# EAGLE design wifibasestation-tssop (EAGLE 6.5.0)
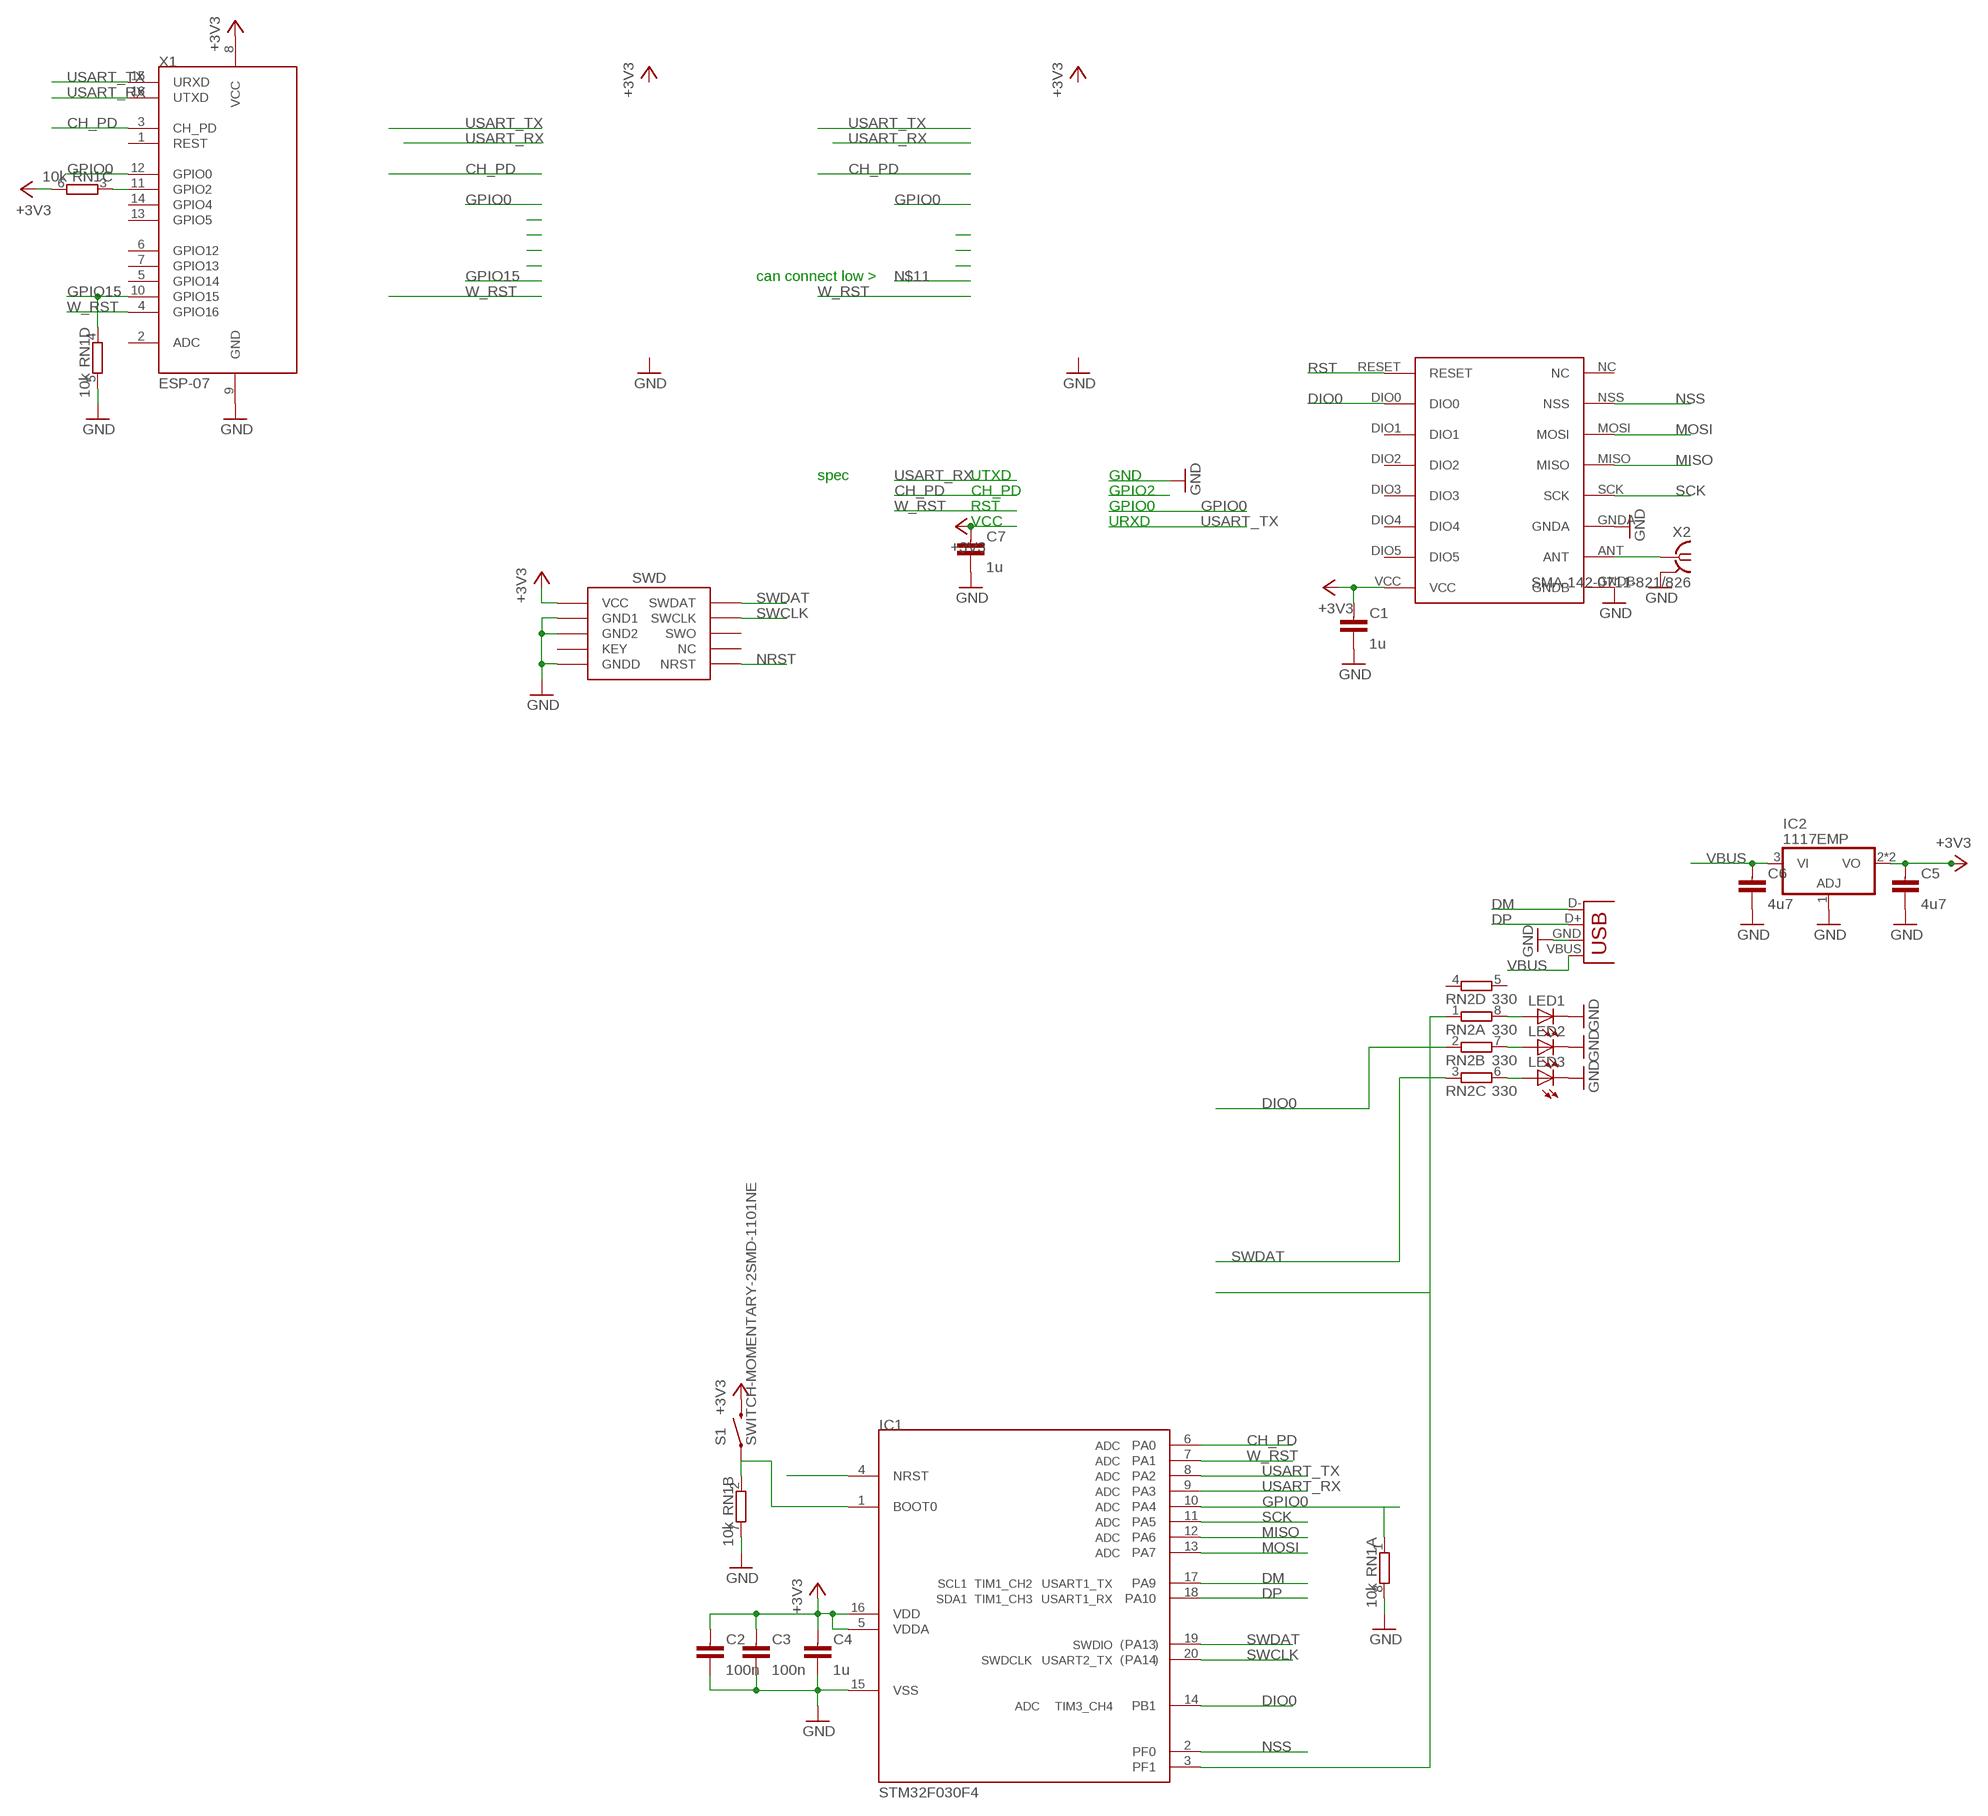
[diagram p0: schematic, sheet 1]

## Parts
C1  1u  CAPACITOR0603-N  [C0603-N]
C2  100n  CAPACITOR0603-N  [C0603-N]
C3  100n  CAPACITOR0603-N  [C0603-N]
C4  1u  CAPACITOR0603-N  [C0603-N]
C5  4u7  CAPACITOR0805-N  [C0805-N]
C6  4u7  CAPACITOR0603-N  [C0603-N]
C7  1u  CAPACITOR0603-N  [C0603-N]
IC1  STM32F030F4  [TSSOP20]
IC2  1117EMP  [SOT223]
J1  SWD_SHROUD_SMD  [SWD_SMD_SHROUD]
JP1  USB-A-H  [USB-A-H]
LED1  LEDCHIP-LED0805  [CHIP-LED0805]
LED2  LEDCHIP-LED0805  [CHIP-LED0805]
LED3  LEDCHIP-LED0805  [CHIP-LED0805]
RN1  10k  4R-NEXB38V  [EXB38V]
RN2  330  4R-NEXB38V  [EXB38V]
S1  SWITCH-MOMENTARY-2SMD-1101NE  [TACTILE-SWITCH-1101NE]
U$1  RFM69HW  [RFM]
X1  ESP-07  [ESP-07]
X2  SMA-142-0711-821/826  [J502-ND-142-0711-821/826]

## Nets
+3V3: C1.1 C2.1 C3.1 C4.1 C5.1 C7.1 IC1.5(VDDA) IC1.16(VDD) IC2.2(VO) IC2.4(VO) J1.1(VCC) RN1.6 S1.2 U$1.VCC X1.8(VCC)
CH_PD: IC1.6(PA0) X1.3(CH_PD)
DIO0: IC1.14(PB1) RN2.2 U$1.DIO0
DM: IC1.17(PA9) JP1.D-(D+)
DP: IC1.18(PA10) JP1.D+(D-)
GND: C1.2 C2.2 C3.2 C4.2 C5.2 C6.2 C7.2 IC1.15(VSS) IC2.1(ADJ) J1.3(GND1) J1.5(GND2) J1.9(GNDD) JP1.GND(VBUS) LED1.C LED2.C LED3.C RN1.5 RN1.7 RN1.8 U$1.GNDA U$1.GNDB X1.9(GND) X2.G@1 X2.G@2 X2.G@3 X2.G@4
GPIO0: IC1.10(PA4) RN1.1 X1.12(GPIO0)
GPIO15: RN1.4 X1.10(GPIO15)
MISO: IC1.12(PA6) U$1.MISO
MOSI: IC1.13(PA7) U$1.MOSI
N$2: IC1.1(BOOT0) RN1.2 S1.1
N$6: U$1.ANT X2.1
N$8: RN1.3 X1.11(GPIO2)
N$9: LED1.A RN2.8
N$10: LED2.A RN2.7
N$20: LED3.A RN2.6
N$22: IC1.3(PF1) RN2.1
NRST: IC1.4(NRST) J1.10(NRST)
NSS: IC1.2(PF0) U$1.NSS
RST: U$1.RESET
SCK: IC1.11(PA5) U$1.SCK
SWCLK: IC1.20(PA14) J1.4(SWCLK)
SWDAT: IC1.19(PA13) J1.2(SWDAT) RN2.3
USART_RX: IC1.9(PA3) X1.16(UTXD)
USART_TX: IC1.8(PA2) X1.15(URXD)
VBUS: C6.1 IC2.3(VI) JP1.VBUS(GND)
W_RST: IC1.7(PA1) X1.4(GPIO16)
Unconnected: J1.6(SWO) J1.7(KEY) J1.8(NC) RN2.4 RN2.5 U$1.DIO1 U$1.DIO2 U$1.DIO3 U$1.DIO4 U$1.DIO5 U$1.NC X1.1(REST) X1.2(ADC) X1.5(GPIO14) X1.6(GPIO12) X1.7(GPIO13) X1.13(GPIO5) X1.14(GPIO4)

## Notes on the sheet
- can connect low >
- spec | UTXD | GND
- CH_PD | GPIO2
- RST | GPIO0
- VCC | URXD

## Library data of the parts
C1-C7 = passives-7351:CAPACITOR
IC1 = dtb:STM32F030F4
IC2 = dtb:*1117: Positive VOLTAGE REGULATOR
J1 = dtb:SWD_SHROUD
JP1 = SparkFun-Connectors:USB: USB Connectors USB-B-PTH is fully proven SKU : PRT-00139/CONN-08278 USB-miniB is fully proven SKU : PRT-00587 USB-A-PCB is untested. USB-A-H is throughly reviewed, but untested. Spark Fun Electronics SKU : PRT-00437 USB-B-SMT is throughly reviewed, but untested. Needs silkscreen touching up. USB-A-S has not been used/tested USB-MB-H has not been used/tested USB-MICROB has been used. CONN-09505
LED1-LED3 = led:LED: LED OSRAM: - CHIPLED LG R971, LG N971, LY N971, LG Q971, LY Q971, LO R971, LY R971 LH N974, LH R974 LS Q976, LO Q976, LY Q976 LO Q996 - Hyper CHIPLED LW Q18S LB Q993, LB Q99A, LB R99A - SideLED LS A670, LO A670, LY A670, LG A670, LP A670 LB A673, LV A673, LT A673, LW A673 LH A674 LY A675 LS A676, LA A676, LO A676, LY A676, LW A676 LS A679, LY A679, LG A679 - Hyper Micro SIDELED® LS Y876, LA Y876, LO Y876, LY Y876 LT Y87S - SmartLED LW L88C, LW L88S LB L89C, LB L89S, LG L890 LS L89K, LO L89K, LY L89K LS L896, LA L896, LO L896, LY L896 - TOPLED LS T670, LO T670, LY T670, LG T670, LP T670 LSG T670, LSP T670, LSY T670, LOP T670, LYG T670 LG T671, LOG T671, LSG T671 LB T673, LV T673, LT T673, LW T673 LH T674 LS T676, LA T676, LO T676, LY T676, LB T676, LH T676, LSB T676, LW T676 LB T67C, LV T67C, LT T67C, LS T67K, LO T67K, LY T67K, LW E67C LS E67B, LA E67B, LO E67B, LY E67B, LB E67C, LV E67C, LT E67C LW T67C LS T679, LY T679, LG T679 LS T770, LO T770, LY T770, LG T770, LP T770 LB T773, LV T773, LT T773, LW T773 LH T774 LS E675, LA E675, LY E675, LS T675 LS T776, LA T776, LO T776, LY T776, LB T776 LHGB T686 LT T68C, LB T68C - Hyper Mini TOPLED® LB M676 - Mini TOPLED Santana® LG M470 LS M47K, LO M47K, LY M47K Source: http://www.osram.convergy.de LUXEON: - LUMILED® LXK2-PW12-R00, LXK2-PW12-S00, LXK2-PW14-U00, LXK2-PW14-V00 LXK2-PM12-R00, LXK2-PM12-S00, LXK2-PM14-U00 LXK2-PE12-Q00, LXK2-PE12-R00, LXK2-PE12-S00, LXK2-PE14-T00, LXK2-PE14-U00 LXK2-PB12-K00, LXK2-PB12-L00, LXK2-PB12-M00, LXK2-PB14-N00, LXK2-PB14-P00, LXK2-PB14-Q00 LXK2-PR12-L00, LXK2-PR12-M00, LXK2-PR14-Q00, LXK2-PR14-R00 LXK2-PD12-Q00, LXK2-PD12-R00, LXK2-PD12-S00 LXK2-PH12-R00, LXK2-PH12-S00 LXK2-PL12-P00, LXK2-PL12-Q00, LXK2-PL12-R00 Source: www.luxeon.com KINGBRIGHT: KA-3528ASYC Source: www.kingbright.com
RN1 RN2 = resistor-dil:4R-N: Array Chip Resistor Source: RS Component / Phycomp; OC_FARNELL: unknown; OC_NEWARK: unknown
S1 = SparkFun-Electromechanical:SWITCH-MOMENTARY-2: Various NO switches- pushbuttons, reed, etc; PROD_ID: SWCH-00815
U$1 = hoperf:RFM69HW
X1 = TiLDA Mk3 Parts:ESP-07
X2 = con-coax:SMA-: SMA 50 Ohm End Launch Jack Receptacle - Round Contact Johnson Components Source: www.johnsoncomponents.com .. J502-ND.pdf; MF: JOHNSON COMPONENTS; MPN: 142-0711-821; OC_FARNELL: 1019328; OC_NEWARK: 16F3627

## Board
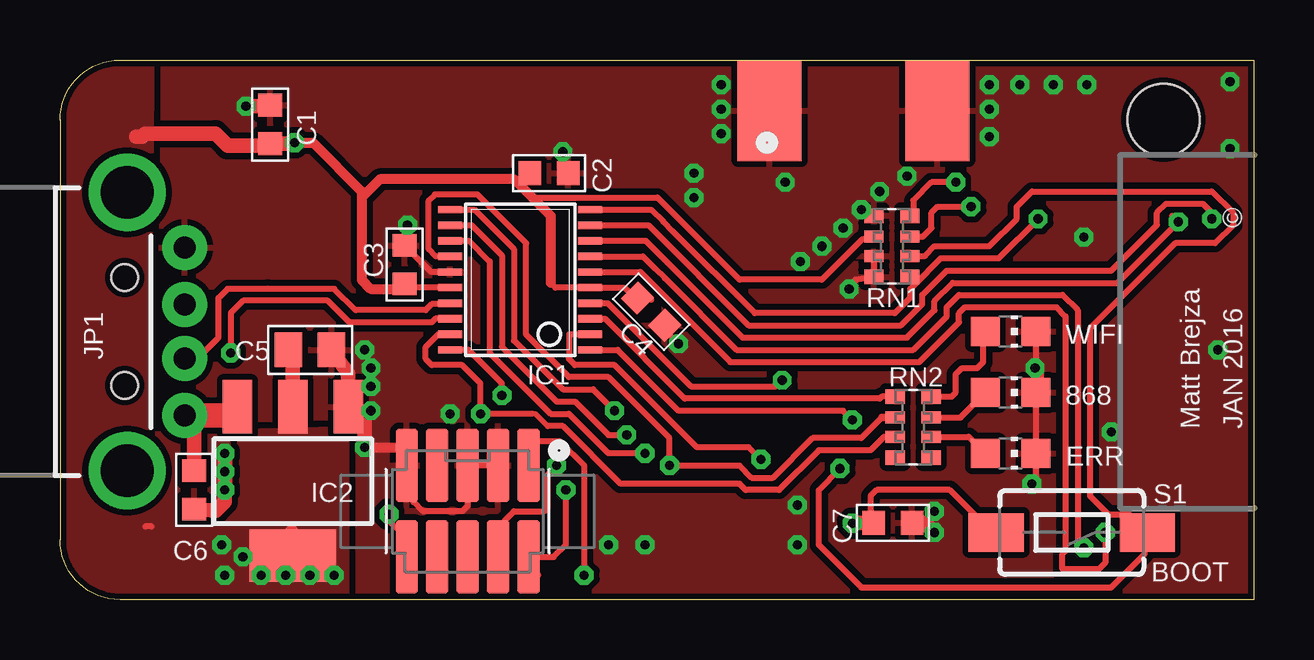
[diagram p1: board, top side]
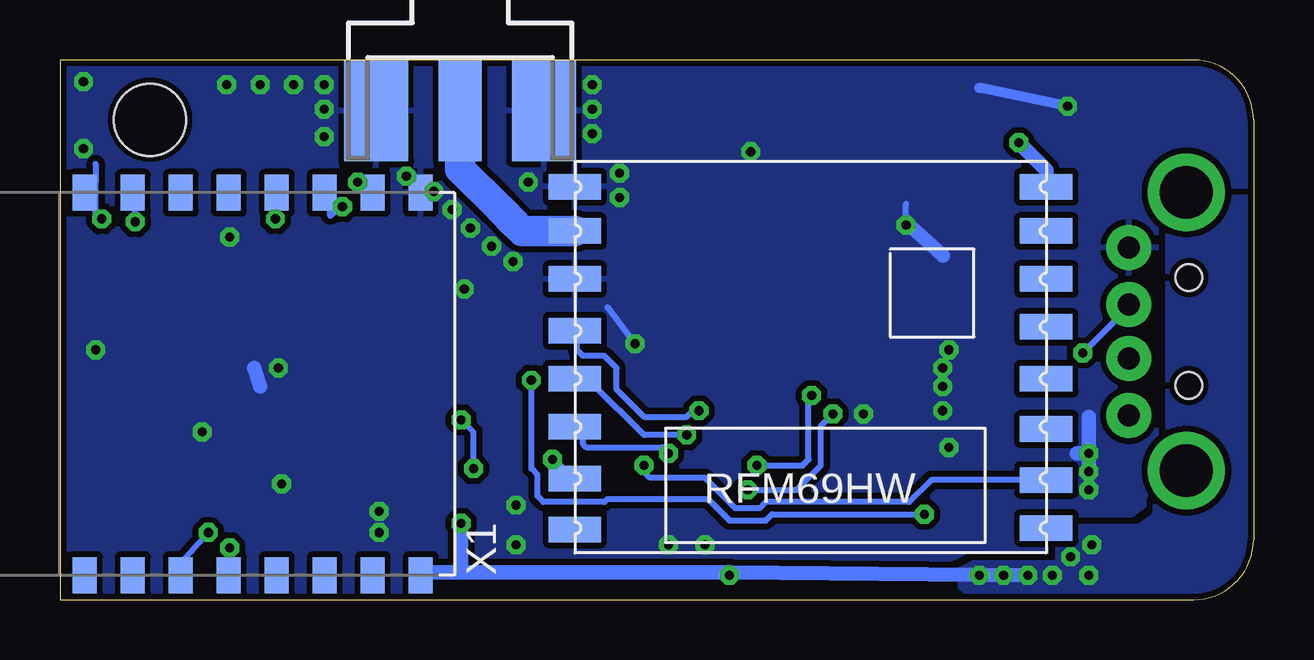
[diagram p2: board, bottom side, seen from below]

Size 49.75 x 22.5 mm. Coordinates in mm from the lower left corner, seen from the top.
Outline: 0,20.01 0,20
Outline: 0,20 0,2.5 arc90 2.5,0 49.75,0 49.75,22.5 2.5,22.5 arc90 0,20
Copper layers (1*16): Top 0.035mm / dielectric 1.5mm / Bottom 0.035mm
Design rules "default *": minimum track width 8mil, minimum drill 15mil, track to track 8mil, track to pad 8mil, pad to pad 7mil, via to via 8mil, smd to smd 0mil, copper to edge 10mil, drill to drill 8mil, minimum pad ring 10mil, minimum via ring 8mil, stop-mask expansion 4mil, vias tented up to drill 16mil, thermal gap 10mil
Holes 3 mm at 45.99,20.01

### Footprints (pad centres in the part's own frame; a part is rotated, then mirrored left to right if it is on the bottom)
C0603-N = smd 0.95 x 1: 1 -0.8,0; 2 0.8,0
C0805-N = smd 1.15 x 1.45: 1 -0.9,0; 2 0.9,0
TSSOP20 = smd 0.305 x 0.991: 1 -2.925,-2.918; 2 -2.275,-2.918; 3 -1.625,-2.918; 4 -0.975,-2.918; 5 -0.325,-2.918; 6 0.325,-2.918; 7 0.975,-2.918; 8 1.625,-2.918; 9 2.275,-2.918; 10 2.925,-2.918; 11 2.925,2.918; 12 2.275,2.918; 13 1.625,2.918; 14 0.975,2.918; 15 0.325,2.918; 16 -0.325,2.918; 17 -0.975,2.918; 18 -1.625,2.918; 19 -2.275,2.918; 20 -2.925,2.918
SOT223 = smd 1.219 x 2.235: 1 -2.311,-3.099; 2 0,-3.099; 3 2.311,-3.099 | smd 3.6 x 2.2: 4 0,3.099
SWD_SMD_SHROUD = smd 0.914 x 3.048: 1 -2.54,-1.905; 2 -2.54,1.905; 3 -1.27,-1.905; 4 -1.27,1.905; 5 0,-1.905; 6 0,1.905; 7 1.27,-1.905; 8 1.27,1.905; 9 2.54,-1.905; 10 2.54,1.905
USB-A-H = drill 0.914 pad 1.88: D+ 2.4,1.127; D- 2.4,-1.127; GND 2.4,3.5; VBUS 2.4,-3.5 | drill 2.2: GND2 0,-5.8; GND3 0,5.8 | hole 1.1: -0.1,2.25; -0.1,-2.25
CHIP-LED0805 = smd 1.2 x 1.2: A 0,-1.05; C 0,1.05
EXB38V = smd 0.6 x 0.8: 1 -1.275,-0.75; 4 1.275,-0.75; 5 1.275,0.75; 8 -1.275,0.75 | smd 0.5 x 0.8: 2 -0.4,-0.75; 3 0.4,-0.75; 6 0.4,0.75; 7 -0.4,0.75
TACTILE-SWITCH-1101NE = smd 2.3 x 1.6: 1 -3.15,0; 2 3.15,0
RFM = smd 2.184 x 1.067: ANT 19.651,2.889; DIO0 0,13.27; DIO1 0,11.143; DIO2 0,9.047; DIO3 0,6.889; DIO4 0,4.889; DIO5 0,2.889; GNDA 19.651,4.889; GNDB 19.651,1.048; MISO 19.651,9.047; MOSI 19.651,11.047; NC 19.651,15.334; NSS 19.651,13.206; RESET 0,15.27; SCK 19.651,7.048; VCC 0,1.048
ESP-07 = smd 1 x 1.5: 1 -13.4,0; 2 -11.4,0; 3 -9.4,0; 4 -7.4,0; 5 -5.4,0; 6 -3.4,0; 7 -1.4,0; 8 0.6,0; 9 0.6,15.95; 10 -1.4,15.95; 11 -3.4,15.95; 12 -5.4,15.95; 13 -7.4,15.95; 14 -9.4,15.95; 15 -11.4,15.95; 16 -13.4,15.95
J502-ND-142-0711-821/826 = smd 4.191 x 1.778: 1 2.115,0 | smd 4.191 x 2.667: G@1 2.115,3.495; G@2 2.115,-3.495 | smd 4.191 x 2.667 bottom: G@3 2.115,3.495; G@4 2.115,-3.495

### Placement (x,y rotation side)
C1  8.77,19.82 90 top
C2  20.39,17.78 0 top
C3  14.37,13.97 90 top
C4  24.64,12.01 315 top
C5  10.42,10.42 0 top
C6  5.59,4.58 270 top
C7  34.72,3.2 0 top
IC1  19.18,13.34 90 top
IC2  9.71,4.94 180 top
J1  16.99,3.69 180 top
JP1  2.8,11.18 0 top
LED1  39.63,11.18 270 top
LED2  39.63,8.64 270 top
LED3  39.63,6.1 270 top
RN1  34.67,14.74 90 top
RN2  35.56,7.2 270 top
S1  42.17,2.8 180 top
U$1  8.64,18.26 180 bottom
X1  35.31,1.02 0 bottom
X2  33.07,22.5 270 bottom

### Tracks (layer width: path | path; a pad name or v marks a point on that pad's centre or on a via)
+3V3  (via drill 0.38)
  Top 0.254: 3.81,3.05 3.56,3.05 | 9.66,10.28 C5.1 | 19.53,5.81 J1.1 19.56,5.62 19.56,6.35 19.82,6.61 20.83,6.61 21.85,5.59 v21.85,1.02 | S1.2 38.87,2.8 37.09,4.58 34.04,4.58 33.79,4.32 33.79,3.33 C7.1 | 24.65,12.51 C4.1 23.51,13.01 IC1.5 20.65,13.01 20.45,13.21 | RN1.6 33.42,15.01 31.75,13.34 28.32,13.34 24.9,16.77 19.69,16.77 | IC1.16 14.36,13.01 14.37,13.03 C3.1 | C2.1 19.59,17.68 19.18,17.28
  Top 0.406: 3.56,19.43 3.43,19.31 | 20.45,13.21 20.45,16.01 19.69,16.77 19.18,17.28 18.93,17.53 13.34,17.53 12.58,16.77 | v9.78,19.05 10.54,19.05 12.58,17.02 12.58,16.77 | 12.58,16.77 12.58,13.34 12.96,12.96 14.16,12.96 C3.1
  Top 0.61: 9.66,2.8 9.91,2.54 | IC2.2 9.71,10 C5.1 | 3.18,19.31 3.43,19.31 | C7.1 33.04,3.2 v33.02,3.18 | 3.56,19.43 6.48,19.43 6.99,18.93 8.68,18.93 C1.1 9.74,19.02 v9.78,19.05
  Bottom 0.254: v21.85,1.02 21.85,1.15
  Bottom 0.61: v9.4,1.02 21.85,1.15 33.28,1.15 | 33.28,1.15 34.58,1.15 X1.8 34.55,1.18 | v33.02,3.18 33.02,1.4 33.28,1.15 | U$1.VCC 8.64,17.91 v9.78,19.05
  other vias: 6.74,2.29 7.62,1.78 8.39,1.02 10.42,1.02 11.43,1.02 6.86,1.02
  pour Top (isolate 0.254): -0.76,22.99 3.81,22.99 3.56,0.26 -0.5,0.77 -0.5,8.39 -0.76,8.39
  pour Bottom (isolate 0.254): 12.2,-2.54 4.07,3.56 4.07,6.1 3.56,7.12 3.56,15.75 4.32,16.51 3.81,17.02 2.29,17.28 2.29,17.53 1.78,16.77 -0.5,16.77 -0.5,-0.76 -0.25,-1.01
  pour Top (isolate 0.254, no thermals): 3.05,0 11.94,0 11.94,6.35 12.45,7.12 2.54,6.86 1.78,5.85 1.78,0.51 2.04,0.26
  pour Bottom (isolate 0.254): 3.56,0 11.69,0 12.2,0.51 12.2,1.27 11.69,1.53 8.13,1.53 8.13,3.05 4.07,3.05 3.81,3.31 3.81,1.53 3.56,1.27
CH_PD  (via drill 0.38)
  Top 0.254: v43.56,2.8 43.56,1.53 43.31,1.27 41.79,1.27 41.79,1.91 41.91,2.04 41.91,11.81 41.53,12.2 37.72,12.2 37.47,11.94 37.47,11.56 35.82,9.91 27.94,9.91 24.19,13.66 IC1.6
  Bottom 0.254: X1.3 44.71,1.53 v43.56,2.8
DIO0  (via drill 0.38)
  Top 0.254: 34.27,7.59 33.41,6.74 31.37,6.74 29.72,5.08 28.83,5.08 28.32,5.59 v25.4,5.59 25.53,5.59 25.4,5.85 25.4,6.74 22.86,9.28 21.21,9.28 19.43,11.05 19.43,14.86 17.4,16.89 15.62,16.89 15.37,16.64 15.37,14.61 15.67,14.31 IC1.14
  Top 0.305: RN2.2 34.27,7.59
  Bottom 0.254: v25.4,5.59 25.66,5.59 25.15,5.08 22.86,5.08 21.59,3.81 20.58,3.81 20.32,4.07 14.36,4.07 13.43,4.99 U$1.DIO0
DM
  Top 0.254: 8.65,12.97 6.99,12.96 | JP1.D- 5.74,10.05 6.61,10.93 6.61,12.58 6.99,12.96 | 6.99,12.96 11.43,12.96 12.32,12.07 15.24,12.07 15.5,12.32 15.88,12.32 15.92,12.36 IC1.17
DP  (via drill 0.38)
  Top 0.254: IC1.18 15.65,11.71 15.5,11.56 12.07,11.56 11.16,12.47 7.64,12.47 7.12,11.94 v7.12,10.29
  Bottom 0.254: JP1.D+ 5.2,12.21 v7.12,10.29
GND  (via drill 0.38)
  Top 0.254: J1.3 J1.5 16.99,3.91 16.77,3.69 15.12,3.69 14.74,4.07 14.74,6.07 J1.9 14.23,6.32 14.23,6.86 | v12.96,7.88 12.18,7.88 IC2.1 | LED1.C LED2.C | LED2.C LED3.C 40.68,5.12 v40.52,4.83 | LED2.C 40.9,8.64 40.9,9.4 v40.64,9.66 | C2.2 21.06,18.14 v20.96,18.67 | v32.9,12.96 33.16,13.33 RN1.8 RN1.7 | RN1.5 33.78,15.88 v33.41,16.26 | v14.48,15.62 14.37,15.51 C3.2 15.48,13.66 IC1.15 | C4.2 25.21,11.25 v25.79,10.67
  Top 0.305: J1.9 14.45,5.81
  Top 0.406: 14.23,6.32 12.74,6.32 v12.7,6.35
  Top 0.61: IC2.1 12.02,9.44 C5.2 | C6.2 6.5,3.7 6.86,4.07 v6.86,5.34 v6.86,6.1 | v12.7,6.35 12.7,7.62 v12.96,7.88 | C7.2 36.05,3.2 v36.45,2.8 | v7.75,20.58 8.73,20.58 C1.2
  Bottom 0.254: v25.79,10.67 26.93,12.2 | v14.48,15.62 14.48,16.51
  Bottom 0.406: v7.75,20.58 11.43,21.34
  Bottom 0.61: 41.66,9.66 41.41,8.89 | 12.96,14.36 14.48,15.75 | v6.86,6.1 6.86,7.62 | v6.86,6.1 v6.86,5.34 | v6.86,6.1 7.37,6.1
  other vias: 34.17,17.02 32.64,15.5 35.31,17.66 38.74,20.45 38.74,21.47 40.01,21.47 42.8,21.47 41.41,21.47 38.74,19.31 27.56,19.43 36.44,3.69 27.56,21.47 27.56,20.45 43.82,6.99 24.39,2.29 22.86,2.29 48.77,21.59 48.77,18.8 48.26,10.42 16.26,7.75 12.7,10.42 12.96,9.66 12.96,8.89 6.86,4.58 31.75,14.74 26.42,16.77 26.42,17.78 30.86,14.1 30.23,17.4 42.68,15.12 30.74,3.94 30.74,2.29
  pour Bottom (isolate 0.254, rank 2): -0.76,22.86 51.82,22.86 51.82,0 -1.77,0 -1.77,1.78
  pour Top (isolate 0.254, rank 4): -0.89,22.61 51.69,22.61 51.69,-0.25 -1.9,-0.25 -1.9,1.53
GPIO0  (via drill 0.38)
  Top 0.254: v40.77,15.88 39.12,14.23 36.71,14.23 35.63,13.15 | 35.63,13.15 35.44,12.96 35.44,12.58 34.8,11.94 28.96,11.94 25.53,15.37 25.15,15.76 24.64,16.26 IC1.10 | RN1.1 35.44,13.33 35.63,13.15
  Bottom 0.254: v40.77,15.88 40.77,17.03 X1.12
GPIO15  (via drill 0.38)
  Top 0.254: v37.34,17.4 36.33,17.4 35.56,16.64 35.56,16.02 RN1.4
  Bottom 0.254: v37.34,17.4 36.58,16.84 X1.10
MISO  (via drill 0.38)
  Top 0.254: v23.63,6.86 22.86,6.86 21.47,8.26 20.7,8.26 18.42,10.54 18.42,14.36 17.16,15.61 IC1.12
  Bottom 0.254: v23.63,6.86 25.4,6.86 27.56,9.02 28.1,9.02 U$1.MISO
MOSI  (via drill 0.38)
  Top 0.254: v24.39,6.1 22.86,6.1 21.21,7.75 20.45,7.75 17.91,10.29 17.91,14.1 17.05,14.96 IC1.13
  Bottom 0.254: v24.39,6.1 24.64,6.35 27.82,6.35 27.94,6.48 27.94,6.87 U$1.MOSI
N$2  (via drill 0.38)
  Top 0.254: v32.52,5.46 31.63,4.58 31.63,2.29 33.41,0.51 43.82,0.51 45.22,1.91 45.22,2.7 S1.1 44.56,3.56 43.69,3.56 42.93,4.32 42.93,11.31 46.49,14.86 48.14,14.86 48.9,15.62 48.9,16.13 48.01,17.02 40.52,17.02 39.88,16.39 39.88,15.88 38.74,14.74 36.45,14.74 36.05,14.34 RN1.2 | IC1.1 23.25,10.41 25.79,7.88 32.64,7.88 32.98,7.54 32.98,7.5
  Top 0.305: v33.02,7.5 32.98,7.5
  Bottom 0.254: v32.52,5.46 32.52,6.99 v33.02,7.5
N$6
  Bottom 1.27: X2.1 33.07,17.96 31.44,16.32 30.74,15.62 30.48,15.37 U$1.ANT
N$8  (via drill 0.38)
  Top 0.254: RN1.3 35.96,15.14 36.33,15.5 36.33,16.13 36.58,16.39 v37.98,16.39
  Bottom 0.254: v37.98,16.39 38.48,16.01 38.48,16.75 X1.11
N$9
  Top 0.254: RN2.8 37.17,8.47 37.34,8.64 37.34,9.4 37.6,9.66 38.23,9.66 38.48,9.91 38.48,11.09 LED1.A
N$10
  Top 0.254: RN2.7 37.53,7.59 LED2.A
N$20
  Top 0.254: RN2.6 37.88,6.79 LED3.A
N$22
  Top 0.254: RN2.1 34.25,8.47 34.17,8.39 26.04,8.39 22.71,11.71 IC1.3
NRST  (via drill 0.38)
  Top 0.254: J1.10 14.2,2.8 13.72,3.27 v13.72,3.56 | v30.1,9.15 29.85,8.89 26.29,8.89 22.82,12.36 IC1.4
  Bottom 0.254: v13.72,3.56 20.07,3.56 20.32,3.31 21.85,3.31 22.74,4.2 26.93,4.2 27.05,4.07 29.59,4.07 29.85,4.32 29.85,5.21 30.1,5.46 v30.1,9.15
NSS  (via drill 0.38)
  Top 0.254: v29.21,5.85 28.71,6.35 26.55,6.35 23.12,9.78 21.47,9.78 21.21,10.04 21.22,11.06 IC1.2
  Bottom 0.254: U$1.NSS 29.31,5.94 v29.21,5.85
SCK  (via drill 0.38)
  Top 0.254: 22.83,7.84 v23.12,7.88 22.23,8.77 20.96,8.77 18.93,10.8 18.93,14.61 17.27,16.26 IC1.11
  Bottom 0.254: v23.12,7.88 23.25,8.01 23.63,7.62 25.4,7.62 26.55,8.77 26.55,9.66 27.05,10.16 27.94,10.16 28.2,10.42 28.2,11.12 U$1.SCK
SWCLK  (via drill 0.38)
  Top 0.254: J1.4 18.55,2.32 18.55,3.31 18.93,3.69 20.2,3.69 20.32,3.81 20.32,5.21 v20.7,5.59 | 18.55,8.39 18.67,8.51 v18.42,8.51 18.42,9.02 17.02,10.42 IC1.20
  Bottom 0.254: v20.7,5.59 18.8,5.59 18.55,5.85 18.55,8.39 v18.42,8.51
SWDAT  (via drill 0.38)
  Top 0.203: 20.32,7.24 19.82,7.75 19.69,7.75
  Top 0.254: v21.09,4.58 21.09,2.29 20.58,1.78 J1.2 19.69,1.62 19.69,1.27 19.94,1.02 | RN2.3 34.35,6.79 33.79,6.23 31.63,6.23 29.98,4.58 28.58,4.58 28.32,4.83 23.37,4.83 20.96,7.24 20.32,7.24 | 17.78,7.75 v17.53,7.75 | 19.69,7.75 v17.53,7.75 | v17.53,7.75 17.53,9.02 16.77,9.78 15.5,9.78 15.24,10.04 15.24,10.54 15.76,11.06 IC1.19
  Bottom 0.254: v21.09,4.58 19.05,4.58 18.04,5.59 18.04,7.24 v17.53,7.75
USART_RX  (via drill 0.38)
  Top 0.254: v48.01,15.88 48.01,16.13 47.63,16.51 46.1,16.51 45.72,16.13 45.72,15.62 43.82,13.72 36.96,13.72 35.95,12.7 35.95,12.32 35.06,11.43 28.71,11.43 24.53,15.61 IC1.9
  Bottom 0.254: v48.01,15.88 48.26,15.88 48.26,17.42 | 48.26,18.16 48.26,17.42 | 48.26,17.42 X1.16
USART_TX  (via drill 0.38)
  Top 0.254: 46.36,16.01 v46.61,15.75 44.07,13.21 37.22,13.21 36.45,12.45 36.45,12.07 35.31,10.93 28.45,10.93 24.41,14.96 IC1.8
  Bottom 0.254: v46.61,15.75 46.61,16.87 X1.15
VBUS
  Top 0.61: C6.1 5.59,7.29 JP1.VBUS
  Top 1.016: JP1.VBUS 7.04,7.68 IC2.3
W_RST  (via drill 0.38)
  Top 0.254: v42.68,2.16 42.42,2.42 42.42,12.07 41.79,12.7 37.47,12.7 36.96,12.2 36.96,11.81 35.56,10.42 28.2,10.42 25.21,13.4 24.81,13.81 24.3,14.31 IC1.7
  Bottom 0.254: v42.68,2.16 42.68,1.05 X1.4

### Text on the board
tPlace: © | WIFI | 868 | Matt Brejza | JAN 2016 | ERR | BOOT